# EAGLE design base-6u-custom-8535 (EAGLE 7.5.0)
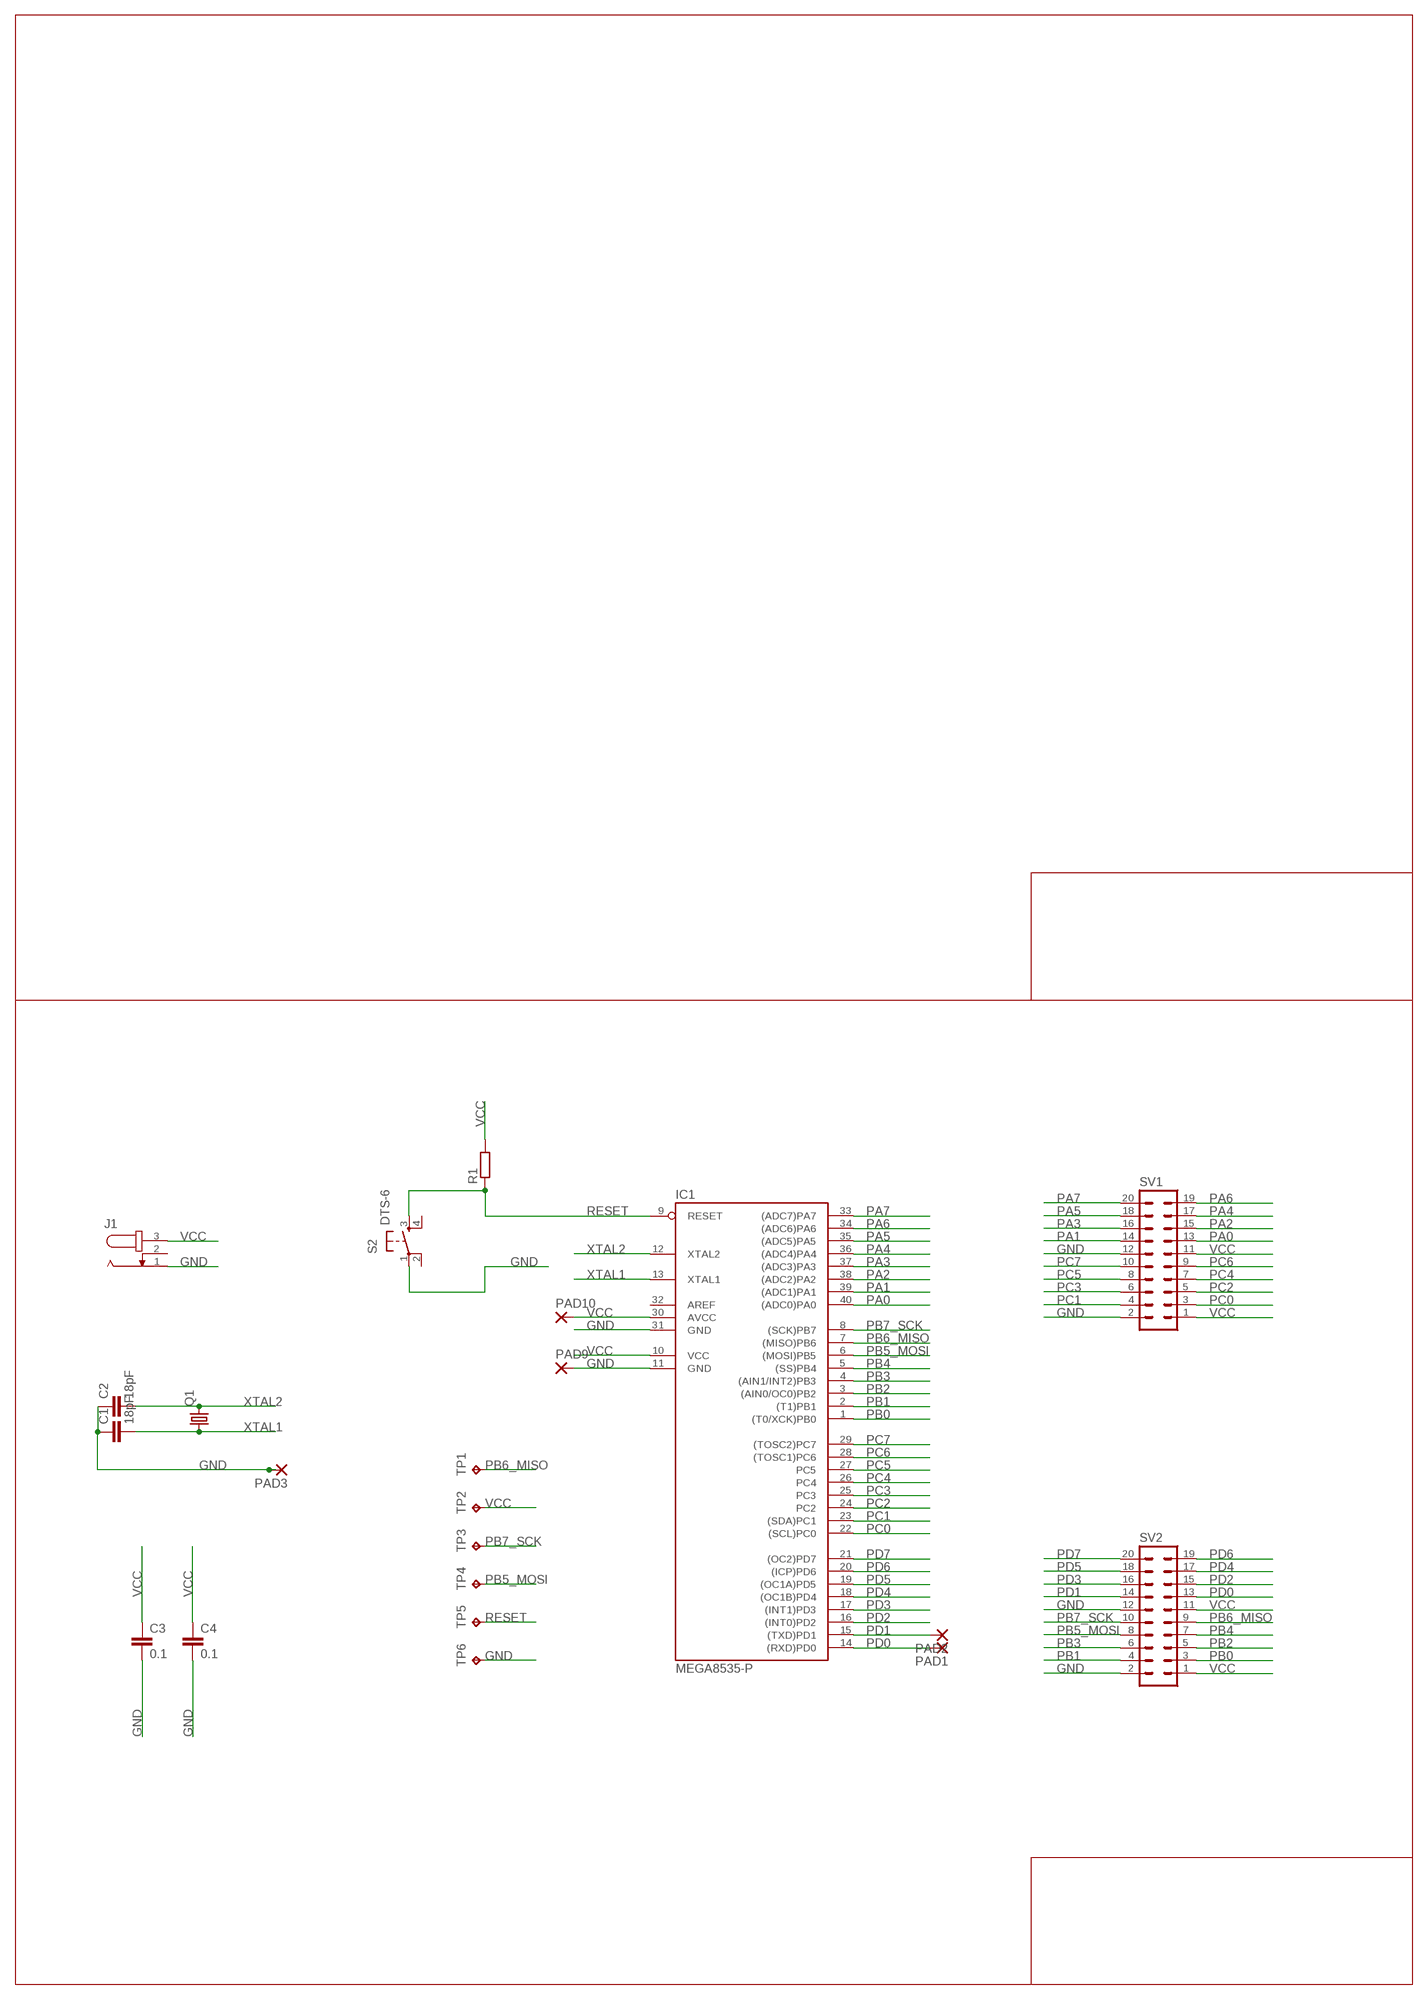
[diagram p0: schematic, sheet 1]

## Parts
C1  18pF  C-EUC0805  [C0805]
C2  18pF  C-EUC0805  [C0805]
C3  0.1  C-EUC0805  [C0805]
C4  0.1  C-EUC0805  [C0805]
IC1  MEGA8535-P  [DIL40]
J1  JACK-PLUG1  [SPC4078]
PAD1  1,6/0,8  [1,6/0,8]
PAD2  1,6/0,8  [1,6/0,8]
PAD3  1,6/0,8  [1,6/0,8]
PAD9  1,6/0,8  [1,6/0,8]
PAD10  1,6/0,8  [1,6/0,8]
Q1  CRYSTALHC49S  [HC49/S]
R1  R-EU_0204/2V  [0204V]
S2  DTS-6  [DTS-6]
SV1  MA10-2  [MA10-2]
SV2  MA10-2  [MA10-2]
TP1  TPTP16R  [TP16R]
TP2  TPTP16R  [TP16R]
TP3  TPTP16R  [TP16R]
TP4  TPTP16R  [TP16R]
TP5  TPTP16R  [TP16R]
TP6  TPTP16R  [TP16R]

## Nets
GND: C1.1 C2.1 C3.2 C4.2 IC1.11(GND) IC1.31(GND) J1.1 PAD3.1(P) PAD9.1(P) S2.1 SV1.2 SV1.12 SV2.2 SV2.12 TP6.TP
PA0: IC1.40((ADC0)PA0) SV1.13
PA1: IC1.39((ADC1)PA1) SV1.14
PA2: IC1.38((ADC2)PA2) SV1.15
PA3: IC1.37((ADC3)PA3) SV1.16
PA4: IC1.36((ADC4)PA4) SV1.17
PA5: IC1.35((ADC5)PA5) SV1.18
PA6: IC1.34((ADC6)PA6) SV1.19
PA7: IC1.33((ADC7)PA7) SV1.20
PB0: IC1.1((T0/XCK)PB0) SV2.3
PB1: IC1.2((T1)PB1) SV2.4
PB2: IC1.3((AIN0/OC0)PB2) SV2.5
PB3: IC1.4((AIN1/INT2)PB3) SV2.6
PB4: IC1.5((SS)PB4) SV2.7
PB5_MOSI: IC1.6((MOSI)PB5) SV2.8 TP4.TP
PB6_MISO: IC1.7((MISO)PB6) SV2.9 TP1.TP
PB7_SCK: IC1.8((SCK)PB7) SV2.10 TP3.TP
PC0: IC1.22((SCL)PC0) SV1.3
PC1: IC1.23((SDA)PC1) SV1.4
PC2: IC1.24(PC2) SV1.5
PC3: IC1.25(PC3) SV1.6
PC4: IC1.26(PC4) SV1.7
PC5: IC1.27(PC5) SV1.8
PC6: IC1.28((TOSC1)PC6) SV1.9
PC7: IC1.29((TOSC2)PC7) SV1.10
PD0: IC1.14((RXD)PD0) PAD1.1(P) SV2.13
PD1: IC1.15((TXD)PD1) PAD2.1(P) SV2.14
PD2: IC1.16((INT0)PD2) SV2.15
PD3: IC1.17((INT1)PD3) SV2.16
PD4: IC1.18((OC1B)PD4) SV2.17
PD5: IC1.19((OC1A)PD5) SV2.18
PD6: IC1.20((ICP)PD6) SV2.19
PD7: IC1.21((OC2)PD7) SV2.20
RESET: IC1.9(RESET) R1.1 S2.3 TP5.TP
VCC: C3.1 C4.1 IC1.10(VCC) IC1.30(AVCC) J1.3 PAD10.1(P) R1.2 SV1.1 SV1.11 SV2.1 SV2.11 TP2.TP
XTAL1: C1.2 IC1.13(XTAL1) Q1.1
XTAL2: C2.2 IC1.12(XTAL2) Q1.2
Unconnected: IC1.32(AREF) J1.2 S2.2 S2.4

## Library data of the parts
C1-C4 = rcl:C-EU: CAPACITOR, European symbol
IC1 = atmel:MEGA8535-P: MICROCONTROLLER 8 Kbytes FLASH 512 bytes SRAM 512 bytes EEPROM USART 8-channel 10 bit ADC Source: avr.lbr; MPN: ATMEGA8535-16PU; OC_FARNELL: 9171444; OC_NEWARK: 01M6909
J1 = con-jack:JACK-PLUG: DC POWER JACK Power Jack, DC, Right Angle, Through Hole, Rated 5A at 16VDC, PC Terminals Distributor: Farnell (www.Farnell.de) Drawing: 84N1161.pdf / 84N1162.pdf Manufacturer: SPC Technology (www.spctechnology.com) Type: SPC4077 / SPC 4078; OC_FARNELL: unknown; OC_NEWARK: unknown
PAD1-PAD3 PAD9 PAD10 = wirepad:1,6/0,8: THROUGH-HOLE PAD
Q1 = crystal:CRYSTAL: CRYSTAL
R1 = rcl:R-EU_: RESISTOR, European symbol
S2 = switch-tact:DTS-6
SV1 SV2 = con-lstb:MA10-2: PIN HEADER; OC_FARNELL: unknown; OC_NEWARK: unknown
TP1-TP6 = testpad:TP: Test pad

## Board
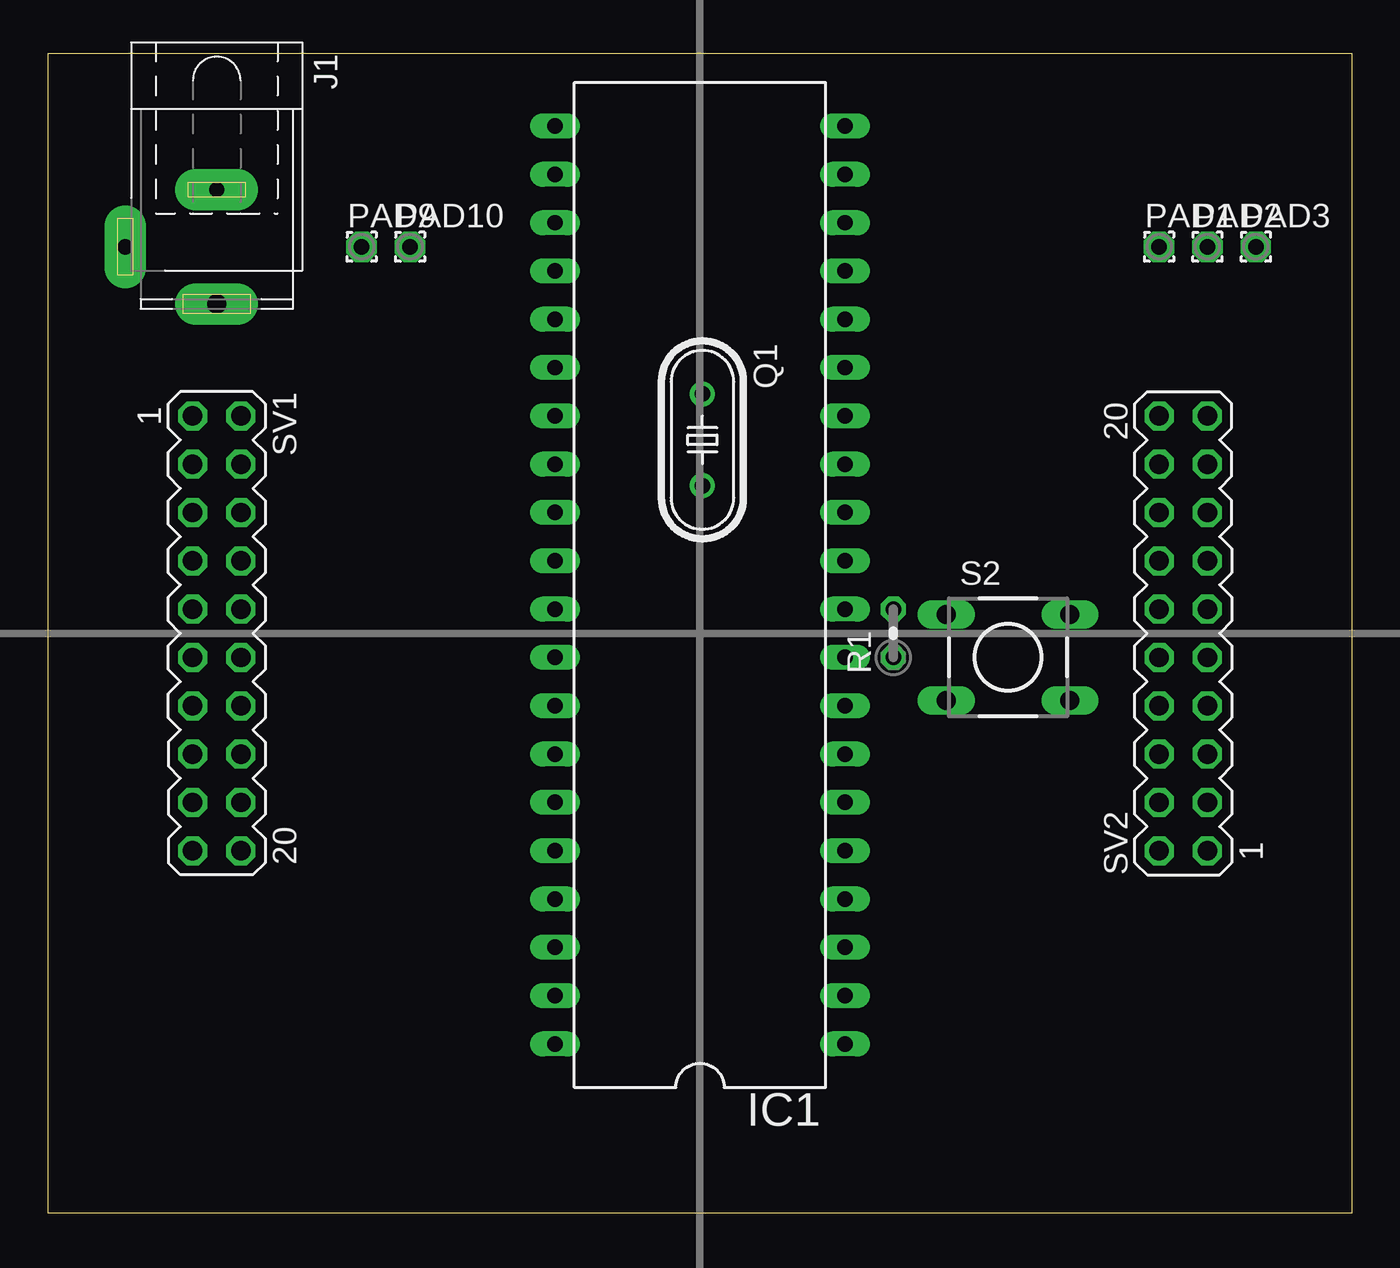
[diagram p1: board, top side]
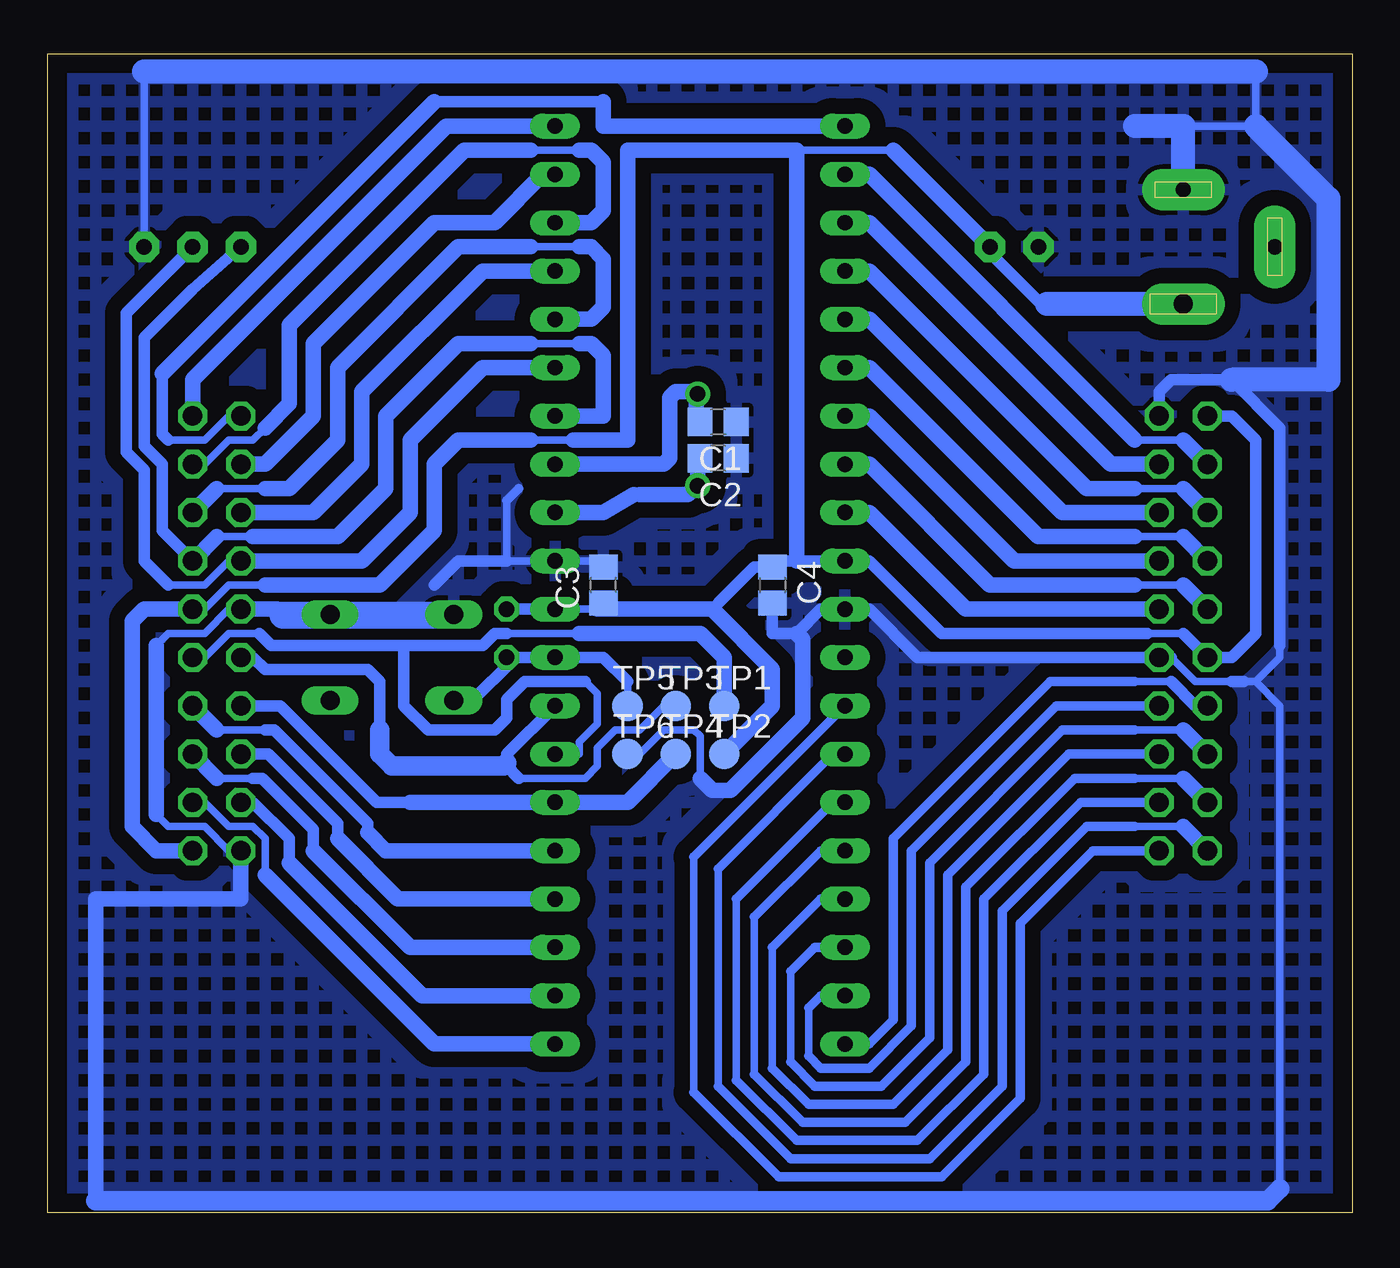
[diagram p2: board, bottom side, seen from below]

Size 68.58 x 60.96 mm. Coordinates in mm from the lower left corner, seen from the top.
Outline: 0,0 68.58,0 68.58,60.96 0,60.96 0,0
Copper layers (1*16): Top 0.035mm / dielectric 1.5mm / Bottom 0.035mm
Design rules "default": minimum track width 10mil, minimum drill 24mil, track to track 8mil, track to pad 8mil, pad to pad 8mil, via to via 8mil, smd to smd 8mil, copper to edge 40mil, drill to drill 8mil, minimum pad ring 10mil, minimum via ring 8mil, stop-mask expansion 4mil, vias tented up to drill 0mil, thermal gap 10mil

### Footprints (pad centres in the part's own frame; a part is rotated, then mirrored left to right if it is on the bottom)
C0805 = smd 1.3 x 1.5: 1 -0.95,0; 2 0.95,0
DIL40 = drill 0.813 long: 1 -24.13,-7.62; 2 -21.59,-7.62; 3 -19.05,-7.62; 4 -16.51,-7.62; 5 -13.97,-7.62; 6 -11.43,-7.62; 7 -8.89,-7.62; 8 -6.35,-7.62; 9 -3.81,-7.62; 10 -1.27,-7.62; 11 1.27,-7.62; 12 3.81,-7.62; 13 6.35,-7.62; 14 8.89,-7.62; 15 11.43,-7.62; 16 13.97,-7.62; 17 16.51,-7.62; 18 19.05,-7.62; 19 21.59,-7.62; 20 24.13,-7.62; 21 24.13,7.62; 22 21.59,7.62; 23 19.05,7.62; 24 16.51,7.62; 25 13.97,7.62; 26 11.43,7.62; 27 8.89,7.62; 28 6.35,7.62; 29 3.81,7.62; 30 1.27,7.62; 31 -1.27,7.62; 32 -3.81,7.62; 33 -6.35,7.62; 34 -8.89,7.62; 35 -11.43,7.62; 36 -13.97,7.62; 37 -16.51,7.62; 38 -19.05,7.62; 39 -21.59,7.62; 40 -24.13,7.62
SPC4078 = drill 0.8 pad 2.184 long: 1 -3,0; 2 0,-4.8 | drill 1 pad 2.184 long: 3 3,0
1,6/0,8 = drill 0.813 pad 1.6 octagon: 1 0,0
HC49/S = drill 0.813: 1 -2.413,0; 2 2.413,0
0204V = drill 0.813 octagon: 1 -1.27,0; 2 1.27,0
DTS-6 = drill 1 long: 1 -3.25,2.25; 2 3.25,2.25; 3 -3.25,-2.25; 4 3.25,-2.25
MA10-2 = drill 1.016 octagon: 1 -11.43,-1.27; 2 -11.43,1.27; 3 -8.89,-1.27; 4 -8.89,1.27; 5 -6.35,-1.27; 6 -6.35,1.27; 7 -3.81,-1.27; 8 -3.81,1.27; 9 -1.27,-1.27; 10 -1.27,1.27; 11 1.27,-1.27; 12 1.27,1.27; 13 3.81,-1.27; 14 3.81,1.27; 15 6.35,-1.27; 16 6.35,1.27; 17 8.89,-1.27; 18 8.89,1.27; 19 11.43,-1.27; 20 11.43,1.27
TP16R = smd 1.6 x 1.6: TP 0,0

### Placement (x,y rotation side)
C1  33.34,41.59 180 bottom
C2  33.34,39.69 180 bottom
C3  39.37,33.02 90 bottom
C4  30.48,33.02 270 bottom
IC1  34.29,33.02 90 top
J1  8.89,50.8 270 top
PAD1  58.42,50.8 0 top
PAD2  60.96,50.8 0 top
PAD3  63.5,50.8 0 top
PAD9  16.51,50.8 0 top
PAD10  19.05,50.8 0 top
Q1  34.42,40.65 270 top
R1  44.45,30.48 90 top
S2  50.48,29.21 0 top
SV1  8.89,30.48 270 top
SV2  59.69,30.48 90 top
TP1  33.02,26.67 0 bottom
TP2  33.02,24.13 0 bottom
TP3  35.56,26.67 0 bottom
TP4  35.56,24.13 0 bottom
TP5  38.1,26.67 0 bottom
TP6  38.1,24.13 0 bottom

### Tracks (layer width: path | path; a pad name or v marks a point on that pad's centre or on a via)
GND
  Bottom 0.406: SV2.12 59.05,31.75 60.32,30.48 62.23,30.48 62.86,29.85 | 25.4,31.75 IC1.31 | 9.52,29.21 8.25,27.94 6.35,27.94 | 5.71,27.94 5.08,27.94 | 5.08,27.94 3.81,26.67 3.81,1.27 | 3.81,29.85 3.81,29.21 5.08,27.94 | 44.45,37.47 44.45,34.29 IC1.11 39.69,34.29 C3.2 | TP6.TP 37.47,24.13 36.19,25.4 34.61,25.4 34.29,25.08 34.29,22.86 | SV2.2 59.05,19.05 60.32,20.32 62.23,20.32 62.86,20.95 | 5.08,60.01 5.08,57.15 8.89,57.15 | 63.5,60.01 PAD3.1
  Bottom 0.508: 43.81,38.1 44.45,37.47
  Bottom 0.61: C4.2 30.48,30.48 29.21,30.48 27.94,31.75 IC1.31 | 25.4,31.75 22.86,29.21 SV1.12 9.52,29.21 | 6.35,27.94 5.71,27.94 | 3.81,29.85 3.81,41.28 6.35,43.81 9.52,43.81 10.16,43.18 SV1.2 | 44.45,34.29 46.99,34.29 48.26,33.02
  Bottom 0.813: 34.29,22.86 33.66,22.22 32.7,22.22 28.89,26.04 28.89,30.16 29.21,30.48 | 62.86,20.95 62.86,29.85 | SV2.2 58.42,16.51 66.04,16.51 66.04,0.63 | SV2.12 56.52,31.75 56.2,31.43
  Bottom 1.016: 3.81,1.27 4.44,0.63 66.04,0.63
  Bottom 1.27: J1.1 8.89,57.15 11.43,57.15 | 5.08,57.15 1.27,53.34 1.27,43.81 6.35,43.81 | 5.08,60.01 63.5,60.01
  Bottom 1.422: 56.2,31.43 46.94,31.43 S2.1
  pour Bottom (isolate 0.813, hatched): 0,60.96 68.58,60.96 68.58,0 0,0
PA0
  Bottom 0.406: 9.52,27.94 11.43,27.94
  Bottom 0.508: IC1.40 25.4,8.89 24.13,10.16 24.13,19.68 15.87,27.94 11.43,27.94
  Bottom 0.61: SV1.13 8.25,26.67 9.52,27.94
PA1
  Bottom 0.406: 28.57,8.25 28.57,10.79
  Bottom 0.508: 28.57,8.25 27.94,7.62 25.4,7.62 23.18,9.84 23.18,19.05 15.56,26.67 SV1.14 | 28.57,10.79 27.94,11.43 IC1.39
PA2
  Bottom 0.406: 29.53,7.94 29.53,12.7 | 8.89,25.4 11.43,25.4
  Bottom 0.508: 29.53,7.94 28.26,6.67 24.76,6.67 22.22,9.21 22.22,18.41 15.24,25.4 11.43,25.4 | 29.53,12.7 28.26,13.97 IC1.38
  Bottom 0.813: SV1.15 8.89,25.4
PA3
  Bottom 0.406: 30.48,7.62 30.48,13.97
  Bottom 0.508: 30.48,7.62 28.57,5.71 24.13,5.71 21.27,8.57 21.27,17.78 14.92,24.13 SV1.16 | 30.48,13.97 27.94,16.51 IC1.37
PA4
  Bottom 0.406: 31.43,7.3 31.43,15.56 | 8.89,22.86 11.43,22.86
  Bottom 0.508: 31.43,7.3 28.89,4.76 23.5,4.76 20.32,7.94 20.32,17.14 14.6,22.86 11.43,22.86 | 31.43,15.56 27.94,19.05 IC1.36
  Bottom 0.813: SV1.17 8.89,22.86
PA5
  Bottom 0.406: 32.39,6.98 32.39,16.51
  Bottom 0.508: SV1.18 14.29,21.59 19.37,16.51 19.37,7.3 22.86,3.81 29.21,3.81 32.39,6.98 | 32.39,16.51 27.3,21.59 IC1.35
PA6
  Bottom 0.406: 8.89,20.32 11.43,20.32 | 33.34,6.67 33.34,18.1
  Bottom 0.508: 33.34,6.67 29.53,2.86 22.22,2.86 18.41,6.67 18.41,15.88 13.97,20.32 11.43,20.32 | 33.34,18.1 27.3,24.13 IC1.34
  Bottom 0.813: SV1.19 8.89,20.32
PA7
  Bottom 0.406: 34.61,6.35 34.61,18.73
  Bottom 0.508: SV1.20 13.65,19.05 17.46,15.24 17.46,6.03 21.59,1.9 30.16,1.9 34.61,6.35 | 34.61,18.73 IC1.33
PB0
  Bottom 0.406: SV2.3 60.32,21.59 59.05,20.32 57.78,20.32 57.15,19.68 57.15,17.78
  Bottom 0.813: 57.15,17.78 48.26,8.89 IC1.1
PB1
  Bottom 0.61: SV2.4 57.78,21.59 55.88,19.68 55.88,18.41
  Bottom 0.813: 55.88,18.41 48.89,11.43 IC1.2
PB2
  Bottom 0.406: 59.69,22.86 57.78,22.86
  Bottom 0.61: 57.78,22.86 57.31,22.86 54.61,20.16 54.61,19.05
  Bottom 0.813: SV2.5 59.69,22.86 | 54.61,19.05 49.53,13.97 IC1.3
PB3
  Bottom 0.61: SV2.6 56.99,24.13 53.34,20.48 53.34,19.68
  Bottom 0.813: 53.34,19.68 50.16,16.51 IC1.4
PB4
  Bottom 0.406: 59.69,25.4 57.15,25.4
  Bottom 0.61: 57.15,25.4 56.67,25.4 51.75,20.48 51.75,20
  Bottom 0.813: SV2.7 59.69,25.4 | 51.75,20 50.8,19.05 IC1.5
PB5_MOSI
  Bottom 0.61: SV2.8 56.36,26.67 51.28,21.59 49.53,21.59
  Bottom 0.813: TP4.TP 38.1,21.59 IC1.6 49.53,21.59
PB6_MISO
  Bottom 0.406: SV2.9 60.32,29.21 59.05,30.48 57.47,30.48 | 40.32,27.94 39.69,27.31 39.69,25.72 40.64,24.76 40.64,24.13 IC1.7 | 40.64,30.48 44.45,30.48
  Bottom 0.61: 40.32,27.94 43.5,27.94 44.45,26.99 44.45,26.04 45.08,25.4 48.58,25.4 49.85,26.67 49.85,29.85 | 44.45,30.48 45.08,30.48 45.72,29.85 49.85,29.85 | 49.85,29.85 56.83,29.85 57.47,30.48
  Bottom 0.813: TP1.TP 33.02,29.21 34.29,30.48 40.64,30.48
PB7_SCK
  Bottom 0.406: TP3.TP 36.19,26.67 37.47,25.4 38.73,25.4 39.69,24.45 39.69,23.5 40.32,22.86 43.81,22.86
  Bottom 0.61: 43.81,22.86 44.45,23.5 44.45,23.65 44.45,24.13 IC1.8 | SV2.10 57.78,29.21 57.15,28.57 51.75,28.57 51.12,27.94 51.12,25.4
  Bottom 1.016: 51.12,25.4 51.12,24.13 50.48,23.5 44.61,23.5 44.45,23.65
PC0
  Bottom 0.406: 8.89,40.64 11.43,40.64
  Bottom 0.813: SV1.3 8.89,40.64 | 11.43,40.64 25.4,54.61 IC1.22
PC1
  Bottom 0.813: SV1.4 12.7,39.37 25.4,52.07 IC1.23
PC2
  Bottom 0.406: 8.89,38.1 11.43,38.1
  Bottom 0.813: SV1.5 8.89,38.1 | 11.43,38.1 13.97,38.1 25.4,49.53 IC1.24
PC3
  Bottom 0.813: SV1.6 15.24,36.83 25.4,46.99 IC1.25
PC4
  Bottom 0.406: 8.89,35.56 11.43,35.56
  Bottom 0.813: SV1.7 8.89,35.56 | 11.43,35.56 16.51,35.56 25.4,44.45 IC1.26
PC5
  Bottom 0.813: SV1.8 17.78,34.29 25.4,41.91 IC1.27
PC6
  Bottom 0.406: 8.89,33.02 11.43,33.02
  Bottom 0.813: SV1.9 8.89,33.02 | 11.43,33.02 19.05,33.02 25.4,39.37 IC1.28
PC7
  Bottom 0.813: SV1.10 20.32,31.75 25.4,36.83 IC1.29
PD0
  Bottom 0.406: 59.69,35.56 57.78,35.56 | 43.18,45.72 40.64,45.72
  Bottom 0.61: SV2.13 62.55,35.88 62.55,39.37 63.5,40.32 63.5,46.04 60.96,48.58 PAD1.1
  Bottom 0.813: SV2.13 59.69,35.56 | 57.78,35.56 53.34,35.56 50.8,38.1 50.8,41.91 46.99,45.72 43.18,45.72 | 40.64,45.72 40,45.72 39.37,45.08 39.37,41.91 IC1.14
PD1
  Bottom 0.406: SV2.14 59.05,34.29 60.32,33.02 62.23,33.02
  Bottom 0.61: 62.23,33.02 63.5,34.29 63.5,39.05 64.45,40 64.45,47.31 PAD2.1 63.82,47.94
  Bottom 0.813: SV2.14 52.07,34.29 49.53,36.83 49.53,40.64 45.72,44.45 IC1.15
PD2
  Bottom 0.406: 59.69,38.1 57.15,38.1 | 43.18,50.8 40.64,50.8
  Bottom 0.813: SV2.15 59.69,38.1 | 57.15,38.1 55.88,38.1 53.34,40.64 53.34,44.45 46.99,50.8 43.18,50.8 | 40.64,50.8 40,50.8 39.37,50.17 39.37,47.62 40,46.99 IC1.16
PD3
  Bottom 0.813: SV2.16 54.61,36.83 52.07,39.37 52.07,43.18 45.72,49.53 IC1.17
PD4
  Bottom 0.406: SV2.17 60.32,39.37 59.05,40.64 57.78,40.64 57.15,41.28 | 43.18,55.88 40.64,55.88
  Bottom 0.813: 57.15,41.28 55.88,42.55 55.88,46.67 46.67,55.88 43.18,55.88 | 40.64,55.88 40,55.88 39.37,55.25 39.37,52.7 40,52.07 IC1.18
PD5
  Bottom 0.813: SV2.18 57.15,39.37 54.61,41.91 54.61,45.72 48.26,52.07 45.08,52.07 42.55,54.61 IC1.19
PD6
  Bottom 0.813: SV2.19 60.96,43.81 47.62,57.15 IC1.20
PD7
  Bottom 0.406: 62.23,40.64 60.32,40.64 59.05,41.91 SV2.20
  Bottom 0.61: 39.37,58.42 40.64,58.42 43.18,58.42 48.26,58.42 | 62.23,40.64 62.55,40.96 62.55,44.13
  Bottom 0.813: IC1.21 39.37,57.15 39.37,58.42 | 62.55,44.13 48.26,58.42
RESET
  Bottom 0.406: 38.1,27.94 TP5.TP
  Bottom 0.61: 38.1,27.94 39.37,29.21 IC1.9 43.97,29.21 44.21,28.97 | 44.21,28.97 46.2,26.99 46.89,26.99 S2.3 | R1.1 44.21,28.97
VCC
  Bottom 0.406: 25.4,34.29 IC1.30 | 30.16,34.29 C4.1 | 10.79,30.48 8.89,30.48 | 33.66,31.75 33.34,32.07 | IC1.10 39.69,31.75 C3.1 | 43.18,40.64 40.96,40.64 | 57.15,33.02 59.05,33.02 60.32,31.75 SV2.11 | 29.21,55.88 24.13,55.88
  Bottom 0.61: 8.89,30.48 SV1.11 6.35,29.21 5.08,30.48 5.08,40.64 6.35,41.91 SV1.1 | 25.4,34.29 21.59,30.48 10.79,30.48 | C4.1 31.43,33.97 33.34,32.07 | IC1.30 29.21,34.29 30.16,34.29 | 16.05,47.8 16.37,47.8 18.73,50.17 18.73,50.48 PAD10.1 | R1.2 IC1.10
  Bottom 0.813: 29.21,34.29 29.21,55.88 38.1,55.88 38.1,40.64 40.96,40.64 | TP2.TP 30.48,26.67 30.48,28.57 33.66,31.75 39.69,31.75 | 57.15,33.02 51.12,33.02 48.26,35.88 48.26,39.37 46.99,40.64 43.18,40.64 | SV2.1 62.86,19.05 64.13,20.32 64.13,31.11 63.5,31.75 SV2.11 | 24.13,55.88 PAD10.1
  Bottom 1.27: J1.3 16.05,47.8
XTAL1
  Bottom 0.508: 41.27,39.69 41.59,39.69 IC1.13 | 34.49,42.03 C1.2
  Bottom 0.813: IC1.13 39.37,39.37 36.19,39.37 35.88,39.69 35.88,42.86 35.56,43.18 34.53,43.18 Q1.1 34.49,42.99 34.49,42.03
XTAL2
  Bottom 0.406: 37.47,37.78 37.78,37.78
  Bottom 0.508: Q1.2 34.47,38.24 | 41.27,36.51 41.59,36.51 IC1.12 | 34.42,39.18 C2.2
  Bottom 0.813: 34.47,38.24 34.92,37.78 37.47,37.78 | Q1.2 34.42,39.18 | 37.78,37.78 39.37,36.83 IC1.12